# Altium schematic sheet VL53L1X-SATEL.SchDoc: VL53L1X Satellite Board
size A4; Date: 2022 Fall; Address1: LK Bulls; Address2: Bagoly Zoltan; Address3: Feher Daniel; Address4: G. Varga Gabor; DocumentNumber: 8; Revision: 1.0; SheetNumber: 8; SheetTotal: 14
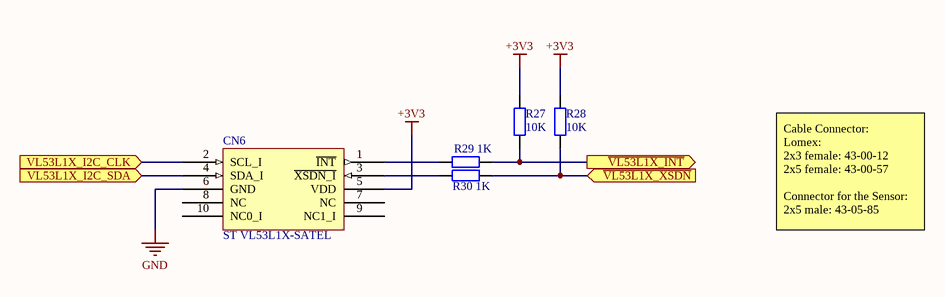
[diagram p0: VL53L1X-SATEL.SchDoc]

## Parts
CN6  ST VL53L1X-SATEL  [FP_DISTANCE_SENSOR]
R27  10K  [FP_0805_RES]
R28  10K  [FP_0805_RES]
R29  1K  [FP_0805_RES]
R30  1K  [FP_0805_RES]

## Ports
VL53L1X_I2C_CLK (in), VL53L1X_I2C_SDA (in), ~{VL53L1X_INT} (out), ~{VL53L1X_XSDN} (in)

## Nets
+3V3: CN6.5(VDD) R27.1 R28.1
GND: CN6.6(GND)
~{VL53L1X_INT}: R27.2 R29.2 ; port ~{VL53L1X_INT}
~{VL53L1X_XSDN}: R28.2 R30.2 ; port ~{VL53L1X_XSDN}
VL53L1X_I2C_CLK: CN6.2(SCL_I) ; port VL53L1X_I2C_CLK
VL53L1X_I2C_SDA: CN6.4(SDA_I) ; port VL53L1X_I2C_SDA
NetCN6_1: CN6.1(~{INT}) R29.1
NetCN6_3: CN6.3(~{XSDN_I}) R30.1

Not connected (* = marked no-connect by the designer): CN6 7(NC) 8(NC) 9(NC1_I) 10(NC0_I)

## Notes on the sheet
- Cable Connector:
  Lomex:
  2x3 female: 43-00-12
  2x5 female: 43-00-57
  Connector for the Sensor:
  2x5 male: 43-05-85
- Title
- Size:
- Date:
- A4
- Number:
- Revision:
- Sheet
- of
- Designed by:
- File:

## Library data of the parts
CN6 = ST_53L1-SATEL-I1: 53L1-SATEL-I1 satellite board for ranging sensor (max distance 4m); Name: SZAL.KABEL 6 P APA BH-06 (T-T); Supplier: Lomex; Reference: 43-26-63
R27 R28 = RES: Resistor; Tolerance: 5%; Power: 0.125W; Name: 10K0 0805 5% CR-05JL7---10K 0.125W (VIK); Supplier: Lomex; Reference: 81-10-99; Value: 10K
R29 R30 = RES: Resistor; Tolerance: 5%; Power: 0.125W; Name: 1K00 0805 5% CR-05JL7----1K 0.125W (VIK); Supplier: Lomex; Reference: 81-10-87; Value: 1K